# EAGLE design Arduino MEGA Buzzer shield (EAGLE 8.7.1)
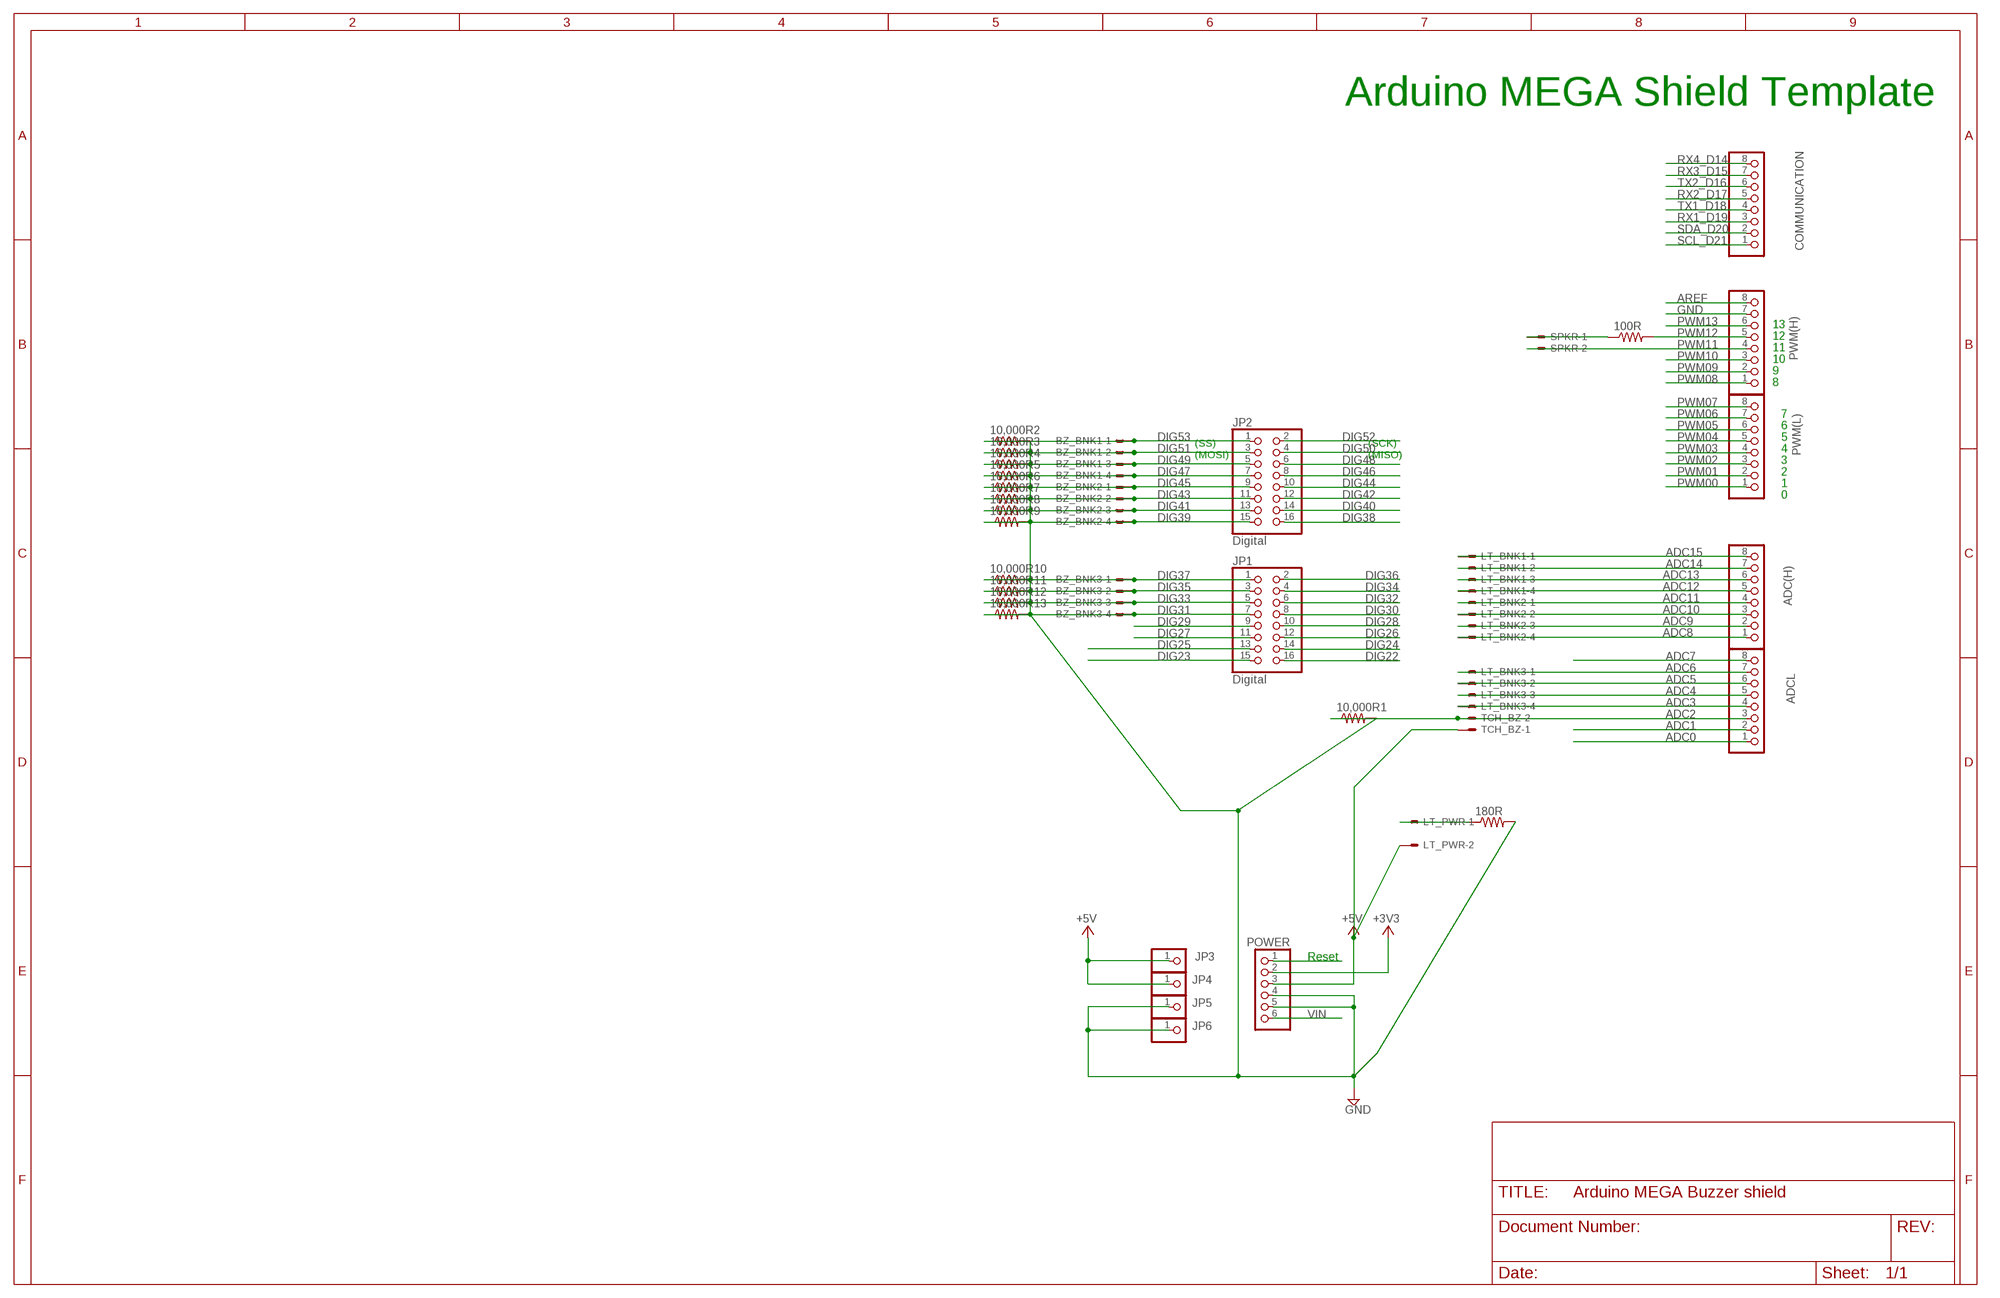
[diagram p0: schematic, sheet 1]

## Parts
10,000R1  R-US_0204/2V  [0204V]
10,000R2  R-US_0204/2V  [0204V]
10,000R3  R-US_0204/2V  [0204V]
10,000R4  R-US_0204/2V  [0204V]
10,000R5  R-US_0204/2V  [0204V]
10,000R6  R-US_0204/2V  [0204V]
10,000R7  R-US_0204/2V  [0204V]
10,000R8  R-US_0204/2V  [0204V]
10,000R9  R-US_0204/2V  [0204V]
10,000R10  R-US_0204/2V  [0204V]
10,000R11  R-US_0204/2V  [0204V]
10,000R12  R-US_0204/2V  [0204V]
10,000R13  R-US_0204/2V  [0204V]
100R  R-US_0204/2V  [0204V]
180R  R-US_0204/2V  [0204V]
ADC(H)  PINHD-1X8  [1X08]
ADCL  PINHD-1X8  [1X08]
BZ_BNK1  KK-156-4  [KK-156-4]
BZ_BNK2  KK-156-4  [KK-156-4]
BZ_BNK3  KK-156-4  [KK-156-4]
COMMUNICATION  PINHD-1X8  [1X08]
JP1  Digital  PINHD-2X8  [2X08]
JP2  Digital  PINHD-2X8  [2X08]
JP3  PINHD-1X1  [1X01]
JP4  PINHD-1X1  [1X01]
JP5  PINHD-1X1  [1X01]
JP6  PINHD-1X1  [1X01]
LT_BNK1  KK-156-4  [KK-156-4]
LT_BNK2  KK-156-4  [KK-156-4]
LT_BNK3  KK-156-4  [KK-156-4]
LT_PWR  KK-156-2  [KK-156-2]
POWER  PINHD-1X6  [1X06]
PWM(H)  PINHD-1X8  [1X08]
PWM(L)  PINHD-1X8  [1X08]
SPKR  KK-156-2  [KK-156-2]
TCH_BZ  KK-156-2  [KK-156-2]

## Nets
+3V3 [power]: POWER.2
+5V [usbvcc]: JP3.1 JP4.1 LT_PWR.2 POWER.3 TCH_BZ.1
ADC0: ADCL.1
ADC1: ADCL.2
ADC2: 10,000R1.1 ADCL.3 TCH_BZ.2
ADC3: ADCL.4 LT_BNK3.4
ADC4: ADCL.5 LT_BNK3.3
ADC5: ADCL.6 LT_BNK3.2
ADC6: ADCL.7 LT_BNK3.1
ADC7: ADCL.8
ADC8: ADC(H).1 LT_BNK2.4
ADC9: ADC(H).2 LT_BNK2.3
ADC10: ADC(H).3 LT_BNK2.2
ADC11: ADC(H).4 LT_BNK2.1
ADC12: ADC(H).5 LT_BNK1.4
ADC13: ADC(H).6 LT_BNK1.3
ADC14: ADC(H).7 LT_BNK1.2
ADC15: ADC(H).8 LT_BNK1.1
AREF: PWM(H).8
DIG22: JP1.16
DIG23: JP1.15
DIG24: JP1.14
DIG25: JP1.13
DIG26 [gnd]: JP1.12
DIG27: JP1.11
DIG28: JP1.10
DIG29: JP1.9
DIG30: JP1.8
DIG31: 10,000R13.1 BZ_BNK3.4 JP1.7
DIG32: JP1.6
DIG33: 10,000R12.1 BZ_BNK3.3 JP1.5
DIG34: JP1.4
DIG35: 10,000R11.1 BZ_BNK3.2 JP1.3
DIG36: JP1.2
DIG37: 10,000R10.1 BZ_BNK3.1 JP1.1
DIG38: JP2.16
DIG39: 10,000R9.1 BZ_BNK2.4 JP2.15
DIG40: JP2.14
DIG41: 10,000R8.1 BZ_BNK2.3 JP2.13
DIG42: JP2.12
DIG43: 10,000R7.1 BZ_BNK2.2 JP2.11
DIG44: JP2.10
DIG45: 10,000R6.1 BZ_BNK2.1 JP2.9
DIG46: JP2.8
DIG47: 10,000R5.1 BZ_BNK1.4 JP2.7
DIG48: JP2.6
DIG49: 10,000R4.1 BZ_BNK1.3 JP2.5
DIG50: JP2.4
DIG51: 10,000R3.1 BZ_BNK1.2 JP2.3
DIG52: JP2.2
DIG53: 10,000R2.1 BZ_BNK1.1 JP2.1
GND [gnd]: 10,000R1.2 10,000R2.2 10,000R3.2 10,000R4.2 10,000R5.2 10,000R6.2 10,000R7.2 10,000R8.2 10,000R9.2 10,000R10.2 10,000R11.2 10,000R12.2 10,000R13.2 180R.2 JP5.1 JP6.1 POWER.4 POWER.5 PWM(H).7
N$2: 180R.1 LT_PWR.1
PWM00: PWM(L).1
PWM01: PWM(L).2
PWM02: PWM(L).3
PWM03: PWM(L).4
PWM04: PWM(L).5
PWM05: PWM(L).6
PWM06: PWM(L).7
PWM07: PWM(L).8
PWM08: PWM(H).1
PWM09: PWM(H).2
PWM10: PWM(H).3
PWM11: PWM(H).4 SPKR.2
PWM12: 100R.2 PWM(H).5
PWM13: PWM(H).6
RESET: POWER.1
RX1_D19: COMMUNICATION.3
RX2_D17: COMMUNICATION.5
RX3_D15: COMMUNICATION.7
RX4_D14: COMMUNICATION.8
SCL_D21: COMMUNICATION.1
SDA_D20: COMMUNICATION.2
SPKR$1: 100R.1 SPKR.1
TX1_D18: COMMUNICATION.4
TX2_D16: COMMUNICATION.6
VIN [power]: POWER.6

## Notes on the sheet
- Arduino MEGA Shield Template
- 13
- 12
- 11
- 10
- 9
- 8
- 7
- 6
- 5
- (SS) | (SCK)
- 4
- (MOSI) | (MISO)
- 3
- 2
- 1
- 0
- Reset

## Library data of the parts
10,000R1-10,000R13 100R 180R = resistor:R-US_: RESISTOR, American symbol
ADC(H) ADCL COMMUNICATION PWM(H) PWM(L) = pinhead:PINHD-1X8: PIN HEADER
BZ_BNK1-BZ_BNK3 LT_BNK1-LT_BNK3 = con-molex:KK-156-4: KK 156 HEADER Source: http://www.molex.com/pdm_docs/sd/026604100_sd.pdf; MF: MOLEX; OC_FARNELL: unknown; OC_NEWARK: unknown
JP1 JP2 = pinhead:PINHD-2X8: PIN HEADER
JP3-JP6 = pinhead:PINHD-1X1: PIN HEADER
LT_PWR SPKR TCH_BZ = con-molex:KK-156-2: KK 156 HEADER Source: http://www.molex.com/pdm_docs/sd/026604100_sd.pdf; MF: MOLEX; OC_FARNELL: unknown; OC_NEWARK: unknown
POWER = pinhead:PINHD-1X6: PIN HEADER

## Net classes
0 default: width 0.203 mm, drill 0.406 mm, clearance 0.203 mm
1 power: width 0.61 mm, drill 0.711 mm, clearance 0.203 mm
2 gnd: width 0.305 mm, drill 0.711 mm, clearance 0.203 mm
3 usbvcc: width 0.508 mm, drill 0.711 mm, clearance 0.203 mm

## Board
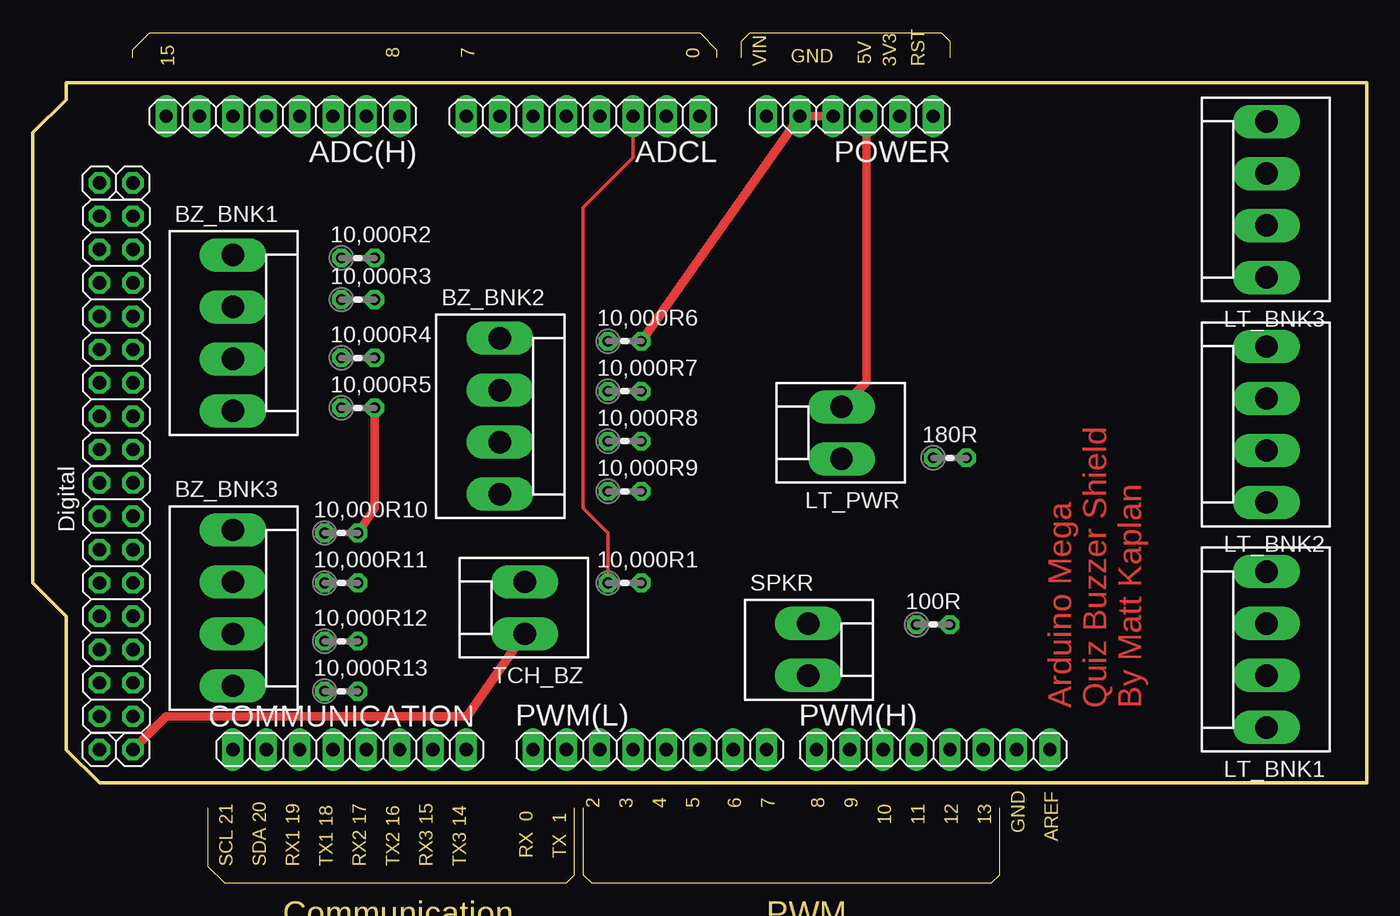
[diagram p1: board, top side]
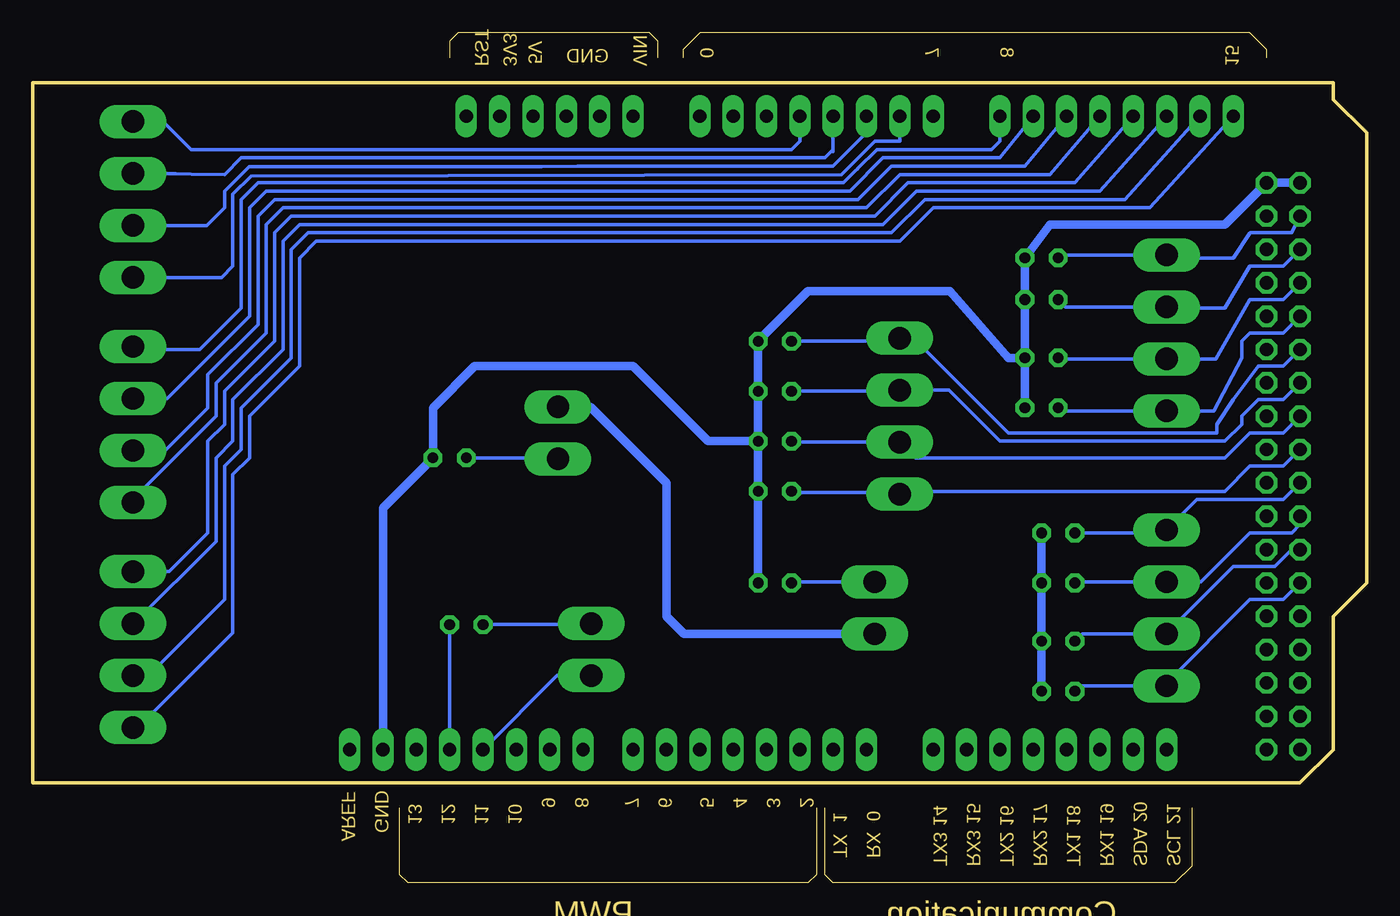
[diagram p2: board, bottom side, seen from below]

Size 101.6 x 64.77 mm. Coordinates in mm from the lower left corner, seen from the top.
Outline: 7.62,62.87 7.62,63.5 8.89,64.77 50.8,64.77 52.07,63.5 52.07,62.87
Outline: 53.98,62.87 53.98,64.13 54.61,64.77 69.22,64.77 69.85,64.13 69.85,62.87
Outline: 13.34,5.71 13.34,1.27 14.61,0 40.64,0 41.27,0.64 41.27,5.71
Outline: 41.91,5.71 41.91,0.64 42.55,0 73.03,0 73.66,0.64 73.66,5.71
Outline: 101.6,7.62 5.08,7.62 2.54,10.16 2.54,20.32 0,22.86 0,57.15 2.54,59.69 2.54,60.96 101.6,60.96 101.6,7.62
Copper layers (1*16): Top 0.035mm / dielectric 1.5mm / Bottom 0.035mm
Design rules "SparkFun *": minimum track width 8mil, minimum drill 20mil, track to track 8mil, track to pad 8mil, pad to pad 8mil, via to via 8mil, smd to smd 8mil, copper to edge 8mil, drill to drill 8mil, minimum pad ring 12mil, minimum via ring 10mil, stop-mask expansion 4mil, vias tented up to drill 20mil, thermal gap 10mil

### Footprints (pad centres in the part's own frame; a part is rotated, then mirrored left to right if it is on the bottom)
0204V = drill 0.813 octagon: 1 -1.27,0; 2 1.27,0
1X08 = drill 1.016 long: 1 -8.89,0; 2 -6.35,0; 3 -3.81,0; 4 -1.27,0; 5 1.27,0; 6 3.81,0; 7 6.35,0; 8 8.89,0
KK-156-4 = drill 1.7 pad 2.184 long: 1 -5.94,0; 2 -1.98,0; 3 1.98,0; 4 5.94,0
2X08 = drill 1.016 octagon: 1 -8.89,-1.27; 2 -8.89,1.27; 3 -6.35,-1.27; 4 -6.35,1.27; 5 -3.81,-1.27; 6 -3.81,1.27; 7 -1.27,-1.27; 8 -1.27,1.27; 9 1.27,-1.27; 10 1.27,1.27; 11 3.81,-1.27; 12 3.81,1.27; 13 6.35,-1.27; 14 6.35,1.27; 15 8.89,-1.27; 16 8.89,1.27
1X01 = drill 1.016 octagon: 1 0,0
KK-156-2 = drill 1.7 pad 2.184 long: 1 -1.98,0; 2 1.98,0
1X06 = drill 1.016 long: 1 -6.35,0; 2 -3.81,0; 3 -1.27,0; 4 1.27,0; 5 3.81,0; 6 6.35,0

### Placement (x,y rotation side)
10,000R1  45.09,22.86 0 top
10,000R2  24.77,47.63 0 top
10,000R3  24.77,44.45 0 top
10,000R4  24.77,40.01 0 top
10,000R5  24.77,36.2 0 top
10,000R6  45.09,41.27 0 top
10,000R7  45.09,37.47 0 top
10,000R8  45.09,33.66 0 top
10,000R9  45.09,29.84 0 top
10,000R10  23.5,26.67 0 top
10,000R11  23.5,22.86 0 top
10,000R12  23.5,18.41 0 top
10,000R13  23.5,14.61 0 top
100R  68.58,19.69 0 top
180R  69.85,32.38 0 top
ADC(H)  19.05,58.42 180 top
ADCL  41.91,58.42 180 top
BZ_BNK1  15.24,41.91 270 top
BZ_BNK2  35.56,35.56 270 top
BZ_BNK3  15.24,20.95 270 top
COMMUNICATION  24.13,10.16 0 top
JP1  6.35,21.59 270 top
JP2  6.35,41.91 270 top
JP3  7.62,10.16 180 top
JP4  5.08,10.16 180 top
JP5  7.62,53.34 180 top
JP6  5.08,53.34 180 top
LT_BNK1  93.98,17.78 90 top
LT_BNK2  93.98,34.93 90 top
LT_BNK3  93.98,52.07 90 top
LT_PWR  61.59,34.29 90 top
POWER  62.23,58.42 180 top
PWM(H)  68.58,10.16 0 top
PWM(L)  46.99,10.16 0 top
SPKR  59.05,17.78 270 top
TCH_BZ  37.47,20.95 90 top

### Tracks (layer width: path | path; a pad name or v marks a point on that pad's centre or on a via)
+5V
  Top 0.635: LT_PWR.2 63.5,38.18 POWER.3 | JP3.1 10.16,12.7 33.09,12.7 TCH_BZ.1
  Bottom 0.635: TCH_BZ.1 52,18.98 53.34,20.32 53.34,30.48 59.13,36.27 LT_PWR.2
ADC2
  Top 0.254: ADCL.3 45.72,55.24 41.91,51.43 41.91,28.58 43.81,26.67 10,000R1.1
  Bottom 0.254: TCH_BZ.2 43.74,22.94 10,000R1.1
ADC3
  Bottom 0.254: LT_BNK3.4 93.75,57.79 91.44,57.79 89.53,55.88 43.81,55.88 43.18,56.52 ADCL.4
ADC4
  Bottom 0.254: 90.73,54.05 92.08,54.05 | 92.08,54.05 LT_BNK3.3 | ADCL.5 40.64,55.88 | 40.64,55.88 40.64,55.7 | 40.64,55.88 41.27,55.24 85.72,55.24 87,53.98 92.08,54.05
ADC5
  Bottom 0.254: ADCL.6 38.1,57.15 40.64,54.61 60.09,54.61 62.86,54.57 85.13,54.57 87,52.71 87,51.43 88.34,50.09 LT_BNK3.2
ADC6
  Bottom 0.254: 35.56,58.29 ADCL.7 35.56,56.52 37.47,56.52 40.01,53.98 84.98,53.86 86.36,52.48 86.36,46.99 87.22,46.13 LT_BNK3.1
ADC8
  Bottom 0.254: LT_BNK2.4 93.75,40.64 88.9,40.64 85.72,43.82 85.72,52.07 84.45,53.34 39.86,53.34 38.93,54.27 38.8,54.38 38.8,54.4 37.32,55.88 28.58,55.88 27.94,56.52 ADC(H).1
ADC9
  Bottom 0.254: ADC(H).2 27.94,55.24 36.83,55.24 39.37,52.71 83.82,52.71 85.09,51.43 85.09,43.18 91.37,36.91 LT_BNK2.3
ADC10
  Bottom 0.254: ADC(H).3 26.04,54.61 36.2,54.61 38.73,52.07 83.19,52.07 84.45,50.8 84.45,42.54 88.27,38.74 88.27,36.2 91.52,32.95 LT_BNK2.2
ADC11
  Bottom 0.254: ADC(H).4 24.13,53.98 35.56,53.98 38.1,51.43 82.55,51.43 83.82,50.16 83.82,41.91 87.63,38.1 87.63,35.56 93.98,29.21 LT_BNK2.1
ADC12
  Bottom 0.254: ADC(H).5 22.23,53.34 34.92,53.34 37.47,50.8 81.91,50.8 83.19,49.53 83.19,41.27 87,37.47 87,34.93 88.27,33.66 88.27,26.67 91.22,23.72 LT_BNK1.4
ADC13
  Bottom 0.254: ADC(H).6 20.32,52.71 34.29,52.71 36.83,50.16 81.28,50.16 82.55,48.9 82.55,40.64 86.36,36.83 86.36,33.66 87.63,32.38 87.63,26.04 93.91,19.76 LT_BNK1.3
ADC14
  Bottom 0.254: ADC(H).7 18.42,52.07 33.66,52.07 36.2,49.53 80.64,49.53 81.91,48.26 81.91,40.01 85.72,36.2 85.72,33.02 87,31.75 87,21.59 92.78,15.8 LT_BNK1.2
ADC15
  Bottom 0.254: ADC(H).8 16.51,51.43 33.02,51.43 35.56,48.9 80.01,48.9 81.28,47.63 81.28,39.37 85.09,35.56 85.09,32.38 86.36,31.12 86.36,19.05 93.98,11.43 LT_BNK1.1
DIG31
  Bottom 0.254: JP1.7 6.35,21.59 8.89,21.59 15.24,15.24 BZ_BNK3.4 21.82,15.02 10,000R13.1
DIG33
  Bottom 0.254: JP1.5 5.72,25.4 6.98,24.13 10.16,24.13 15.24,19.05 BZ_BNK3.3 21.67,18.98 10,000R12.1
DIG35
  Bottom 0.254: JP1.3 5.08,27.3 5.72,26.67 8.89,26.67 12.62,22.94 BZ_BNK3.2 22.15,22.94 10,000R11.1
DIG37
  Bottom 0.254: JP1.1 6.35,29.21 12.93,29.21 BZ_BNK3.1 15.47,26.67 10,000R10.1
DIG39
  Bottom 0.254: JP2.15 6.35,31.75 8.89,31.75 10.8,29.84 35.34,29.84 35.45,29.73 | 35.45,29.73 BZ_BNK2.4 | 10,000R9.1 43.7,29.73 35.45,29.73
DIG41
  Bottom 0.254: JP2.13 6.35,34.29 8.89,34.29 10.8,32.38 34.37,32.38 BZ_BNK2.3 43.74,33.58 10,000R8.1
DIG43
  Bottom 0.254: JP2.11 6.35,36.83 8.26,36.83 9.52,35.56 9.52,34.93 10.8,33.66 27.94,33.66 31.83,37.54 BZ_BNK2.2 36.12,37.54 36.2,37.47 10,000R7.1
DIG45
  Bottom 0.254: JP2.9 6.35,39.37 8.26,39.37 10.16,36.83 11.43,34.93 11.43,34.29 27.3,34.29 34.52,41.5 BZ_BNK2.1 35.79,41.27 10,000R6.1
DIG47
  Bottom 0.254: JP2.7 6.35,41.91 8.89,41.91 9.52,41.27 9.52,40.01 11.66,35.97 BZ_BNK1.4 23.27,35.97 10,000R5.1
DIG49
  Bottom 0.254: JP2.5 6.35,44.45 8.89,44.45 11.51,39.93 BZ_BNK1.3 23.42,39.93 10,000R4.1
DIG51
  Bottom 0.254: JP2.3 6.35,46.99 8.89,46.99 10.8,43.82 15.16,43.82 BZ_BNK1.2 22.94,43.89 10,000R3.1
DIG53
  Bottom 0.254: JP2.1 5.72,49.53 8.88,49.53 8.88,49.52 8.9,49.52 10.16,47.63 15.02,47.63 BZ_BNK1.1 23.27,47.85 10,000R2.1
GND
  Top 0.635: POWER.4 POWER.5 10,000R6.2 | 10,000R10.2 26.04,28.58 10,000R5.2
  Bottom 0.635: 10,000R4.2 10,000R3.2 10,000R2.2 24.13,50.16 10.8,50.16 JP5.1 JP6.1 | 10,000R4.2 10,000R5.2 | 10,000R10.2 10,000R11.2 10,000R12.2 10,000R13.2 | 10,000R8.2 10,000R9.2 10,000R1.2 | 10,000R8.2 10,000R7.2 10,000R6.2 42.55,45.09 31.75,45.09 27.3,40.01 10,000R4.2 | 10,000R8.2 50.16,33.66 55.88,39.37 67.94,39.37 71.12,36.2 180R.2 74.93,28.58 PWM(H).7
N$2
  Bottom 0.254: LT_PWR.1 61.67,32.38 180R.1
PWM11
  Bottom 0.254: 67.31,11.43 PWM(H).4 61.67,15.8 SPKR.2
PWM12
  Bottom 0.254: 100R.2 PWM(H).5
SPKR$1
  Bottom 0.254: SPKR.1 58.98,19.69 100R.1

### Text on the board
Top: Arduino Mega / Quiz Buzzer Shield / By Matt Kaplan
Dimension: 5V | 3V3 | GND | 15 | 8 | 7 | 0 | VIN | RST | 2 | 3 | 4 | 5 | 6 | 7 | 8 | 9 | 10 | 11 | 12 | 13 | GND | AREF | SCL 21 | SDA 20 | RX1 19 | TX1 18 | RX2 17 | TX2 16 | RX3 15 | TX3 14 | RX 0 | TX 1 | Communication | PWM
tOrigins: Analog In | Power